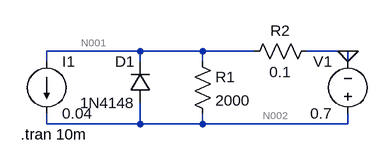
[diagram p0: schematic Draft3.asc]
Draft3.asc, the LTspice schematic file:
Version 4
SHEET 1 880 680
WIRE 208 128 64 128
WIRE 304 128 208 128
WIRE 384 128 304 128
WIRE 528 128 464 128
WIRE 64 144 64 128
WIRE 208 144 208 128
WIRE 304 144 304 128
WIRE 528 144 528 128
WIRE 64 240 64 224
WIRE 208 240 208 208
WIRE 208 240 64 240
WIRE 304 240 304 224
WIRE 304 240 208 240
WIRE 528 240 528 224
WIRE 528 240 304 240
FLAG 528 128 0
SYMBOL diode 224 208 R180
WINDOW 0 24 64 Left 2
WINDOW 3 24 0 Left 2
SYMATTR InstName D1
SYMATTR Value 1N4148
SYMBOL current 64 144 R0
WINDOW 123 0 0 Left 0
WINDOW 39 0 0 Left 0
SYMATTR InstName I1
SYMATTR Value 0.04
SYMBOL res 288 128 R0
SYMATTR InstName R1
SYMATTR Value 2000
SYMBOL res 480 112 R90
WINDOW 0 0 56 VBottom 2
WINDOW 3 32 56 VTop 2
SYMATTR InstName R2
SYMATTR Value 0.1
SYMBOL voltage 528 240 R180
WINDOW 0 24 96 Left 2
WINDOW 3 24 16 Left 2
WINDOW 123 0 0 Left 0
WINDOW 39 0 0 Left 0
SYMATTR InstName V1
SYMATTR Value 0.7
TEXT 24 256 Left 2 !.tran 10m

The netlist it stands for:
* Draft3.asc
D1 N002 N001 1N4148
I1 N001 N002 0.04
R1 N001 N002 2000
R2 0 N001 0.1
V1 N002 0 0.7
.model D D
.lib standard.dio
.tran 10m
.backanno
.end

* Results of the author's LTspice run, read from the files saved beside the schematic
* Operating Point, zero values left out:
*   V(n002) = 700 mV
*   V(n001) = -2.783 mV
*   I(D1) = 11.81 mA
*   I(I1) = 40 mA
*   I(R1) = -351.4 µA
*   I(R2) = 27.83 mA
*   I(V1) = 27.83 mA